# Altium project VOU_SOM_CV_V0.0.1.PrjPcb (part 2 of 2)

## Sheet HPS_DDR3.SchDoc
size A1
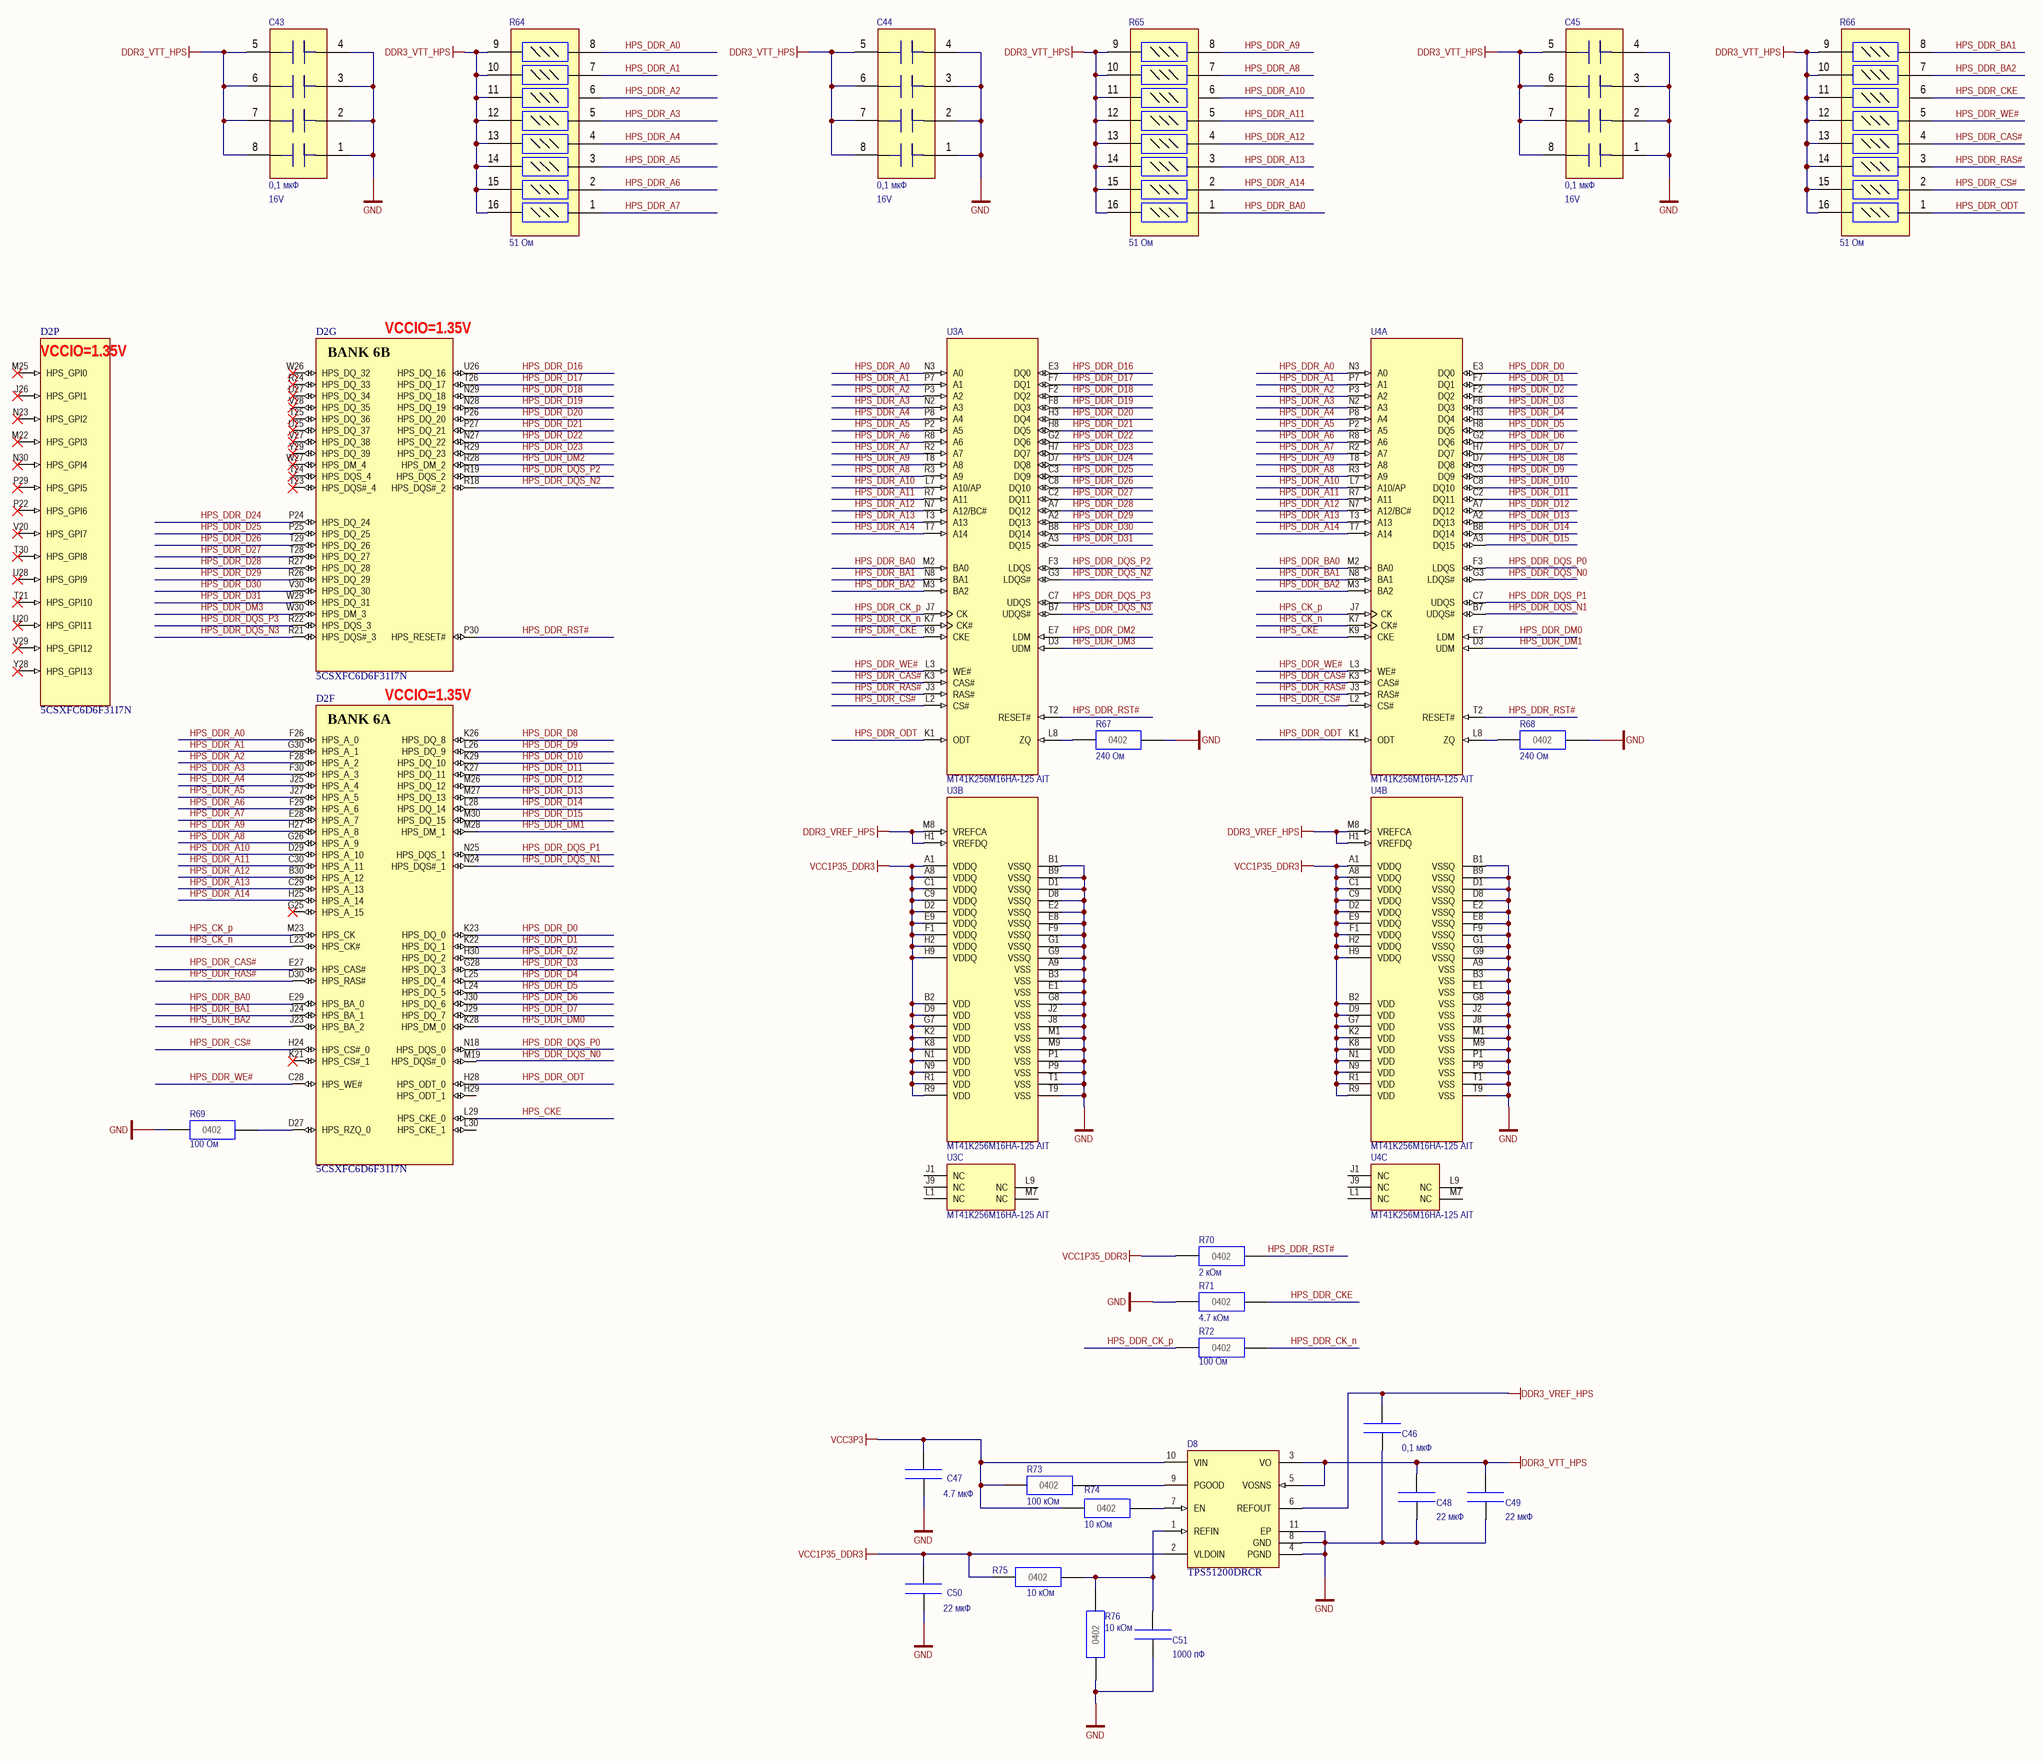
[diagram p5: HPS_DDR3.SchDoc]

### Parts
C43  value 0,1 мкФ  V: 16V  [CAF-80P319X159-8N]  (hidden comment: W3A4YC104KAT2A)
C44  value 0,1 мкФ  V: 16V  [CAF-80P319X159-8N]  (hidden comment: W3A4YC104KAT2A)
C45  value 0,1 мкФ  V: 16V  [CAF-80P319X159-8N]  (hidden comment: W3A4YC104KAT2A)
C46  value 0,1 мкФ  [CC0402(1005)]  (hidden comment: CC0402-X7R-0,1 мкФ-20%-10В)
C47  value 4.7 мкФ  [CC0402(1005)]  (hidden comment: CC0402-X5R-4.7 мкФ-20%-6.3В)
C48  value 22 мкФ  [CC0402(1005)]  (hidden comment: CC0402-X5R-22 мкФ-20%-6.3В)
C49  value 22 мкФ  [CC0402(1005)]  (hidden comment: CC0402-X5R-22 мкФ-20%-6.3В)
C50  value 22 мкФ  [CC0402(1005)]  (hidden comment: CC0402-X5R-22 мкФ-20%-6.3В)
C51  value 1000 пФ  [CC0402(1005)]  (hidden comment: CC0402-NP01000 пФ-1%-50В)
D2  5CSXFC6D6F31I7N  [ALTR-FBGA896_A-200]  (parts F,G,P of 24)
D8  TPS51200DRCR  [TI-DRC10-2400X1650TP_V]
R64  value 51 Ом  [CAT16-J8]  (hidden comment: YC248-JR-07-51 Ом)
R65  value 51 Ом  [CAT16-J8]  (hidden comment: YC248-JR-07-51 Ом)
R66  value 51 Ом  [CAT16-J8]  (hidden comment: YC248-JR-07-51 Ом)
R67  value 240 Ом  [CR0402(1005)]  (hidden comment: CR0402-240 Ом-±5%)
R68  value 240 Ом  [CR0402(1005)]  (hidden comment: CR0402-240 Ом-±5%)
R69  value 100 Ом  [CR0402(1005)]  (hidden comment: CR0402-100 Ом-±5%)
R70  value 2 кОм  [CR0402(1005)]  (hidden comment: CR0402-2 кОм-±5%)
R71  value 4.7 кОм  [CR0402(1005)]  (hidden comment: CR0402-4.7 кОм-±5%)
R72  value 100 Ом  [CR0402(1005)]  (hidden comment: CR0402-100 Ом-±5%)
R73  value 100 кОм  [CR0402(1005)]  (hidden comment: CR0402-100 кОм-±5%)
R74  value 10 кОм  [CR0402(1005)]  (hidden comment: CR0402-10 кОм-±5%)
R75  value 10 кОм  [CR0402(1005)]  (hidden comment: CR0402-10 кОм-±5%)
R76  value 10 кОм  [CR0402(1005)]  (hidden comment: CR0402-10 кОм-±5%)
U3  MT41K256M16HA-125 AIT  [MICT-HA-96]  (parts A,B,C of 3)
U4  MT41K256M16HA-125 AIT  [MICT-HA-96]  (parts A,B,C of 3)

### Nets
DDR3_VREF_HPS: C46.1(+) D8.6(REFOUT) U3.H1(VREFDQ) U3.M8(VREFCA) U4.H1(VREFDQ) U4.M8(VREFCA)
DDR3_VTT_HPS: C43.5 C43.6 C43.7 C43.8 C44.5 C44.6 C44.7 C44.8 C45.5 C45.6 C45.7 C45.8 C48.1(+) C49.1(+) D8.3(VO) D8.5(VOSNS) R64.9 R64.10 R64.11 R64.12 R64.13 R64.14 R64.15 R64.16 R65.9 R65.10 R65.11 R65.12 R65.13 R65.14 R65.15 R65.16 R66.9 R66.10 R66.11 R66.12 R66.13 R66.14 R66.15 R66.16
GND: C43.1 C43.2 C43.3 C43.4 C44.1 C44.2 C44.3 C44.4 C45.1 C45.2 C45.3 C45.4 C46.2(-) C47.2(-) C48.2(-) C49.2(-) C50.2(-) C51.2(-) D8.4(PGND) D8.8(GND) D8.11(EP) R67.2(-) R68.2(-) R69.1(+) R71.1(+) R76.1(+) U3.A9(VSS) U3.B1(VSSQ) U3.B3(VSS) U3.B9(VSSQ) U3.D1(VSSQ) U3.D8(VSSQ) U3.E1(VSS) U3.E2(VSSQ) U3.E8(VSSQ) U3.F9(VSSQ) U3.G1(VSSQ) U3.G8(VSS) U3.G9(VSSQ) U3.J2(VSS) U3.J8(VSS) U3.M1(VSS) U3.M9(VSS) U3.P1(VSS) U3.P9(VSS) U3.T1(VSS) U3.T9(VSS) U4.A9(VSS) U4.B1(VSSQ) U4.B3(VSS) U4.B9(VSSQ) U4.D1(VSSQ) U4.D8(VSSQ) U4.E1(VSS) U4.E2(VSSQ) U4.E8(VSSQ) U4.F9(VSSQ) U4.G1(VSSQ) U4.G8(VSS) U4.G9(VSSQ) U4.J2(VSS) U4.J8(VSS) U4.M1(VSS) U4.M9(VSS) U4.P1(VSS) U4.P9(VSS) U4.T1(VSS) U4.T9(VSS)
VCC1P35_DDR3: C50.1(+) D8.2(VLDOIN) R70.1(+) R75.1(+) U3.A1(VDDQ) U3.A8(VDDQ) U3.B2(VDD) U3.C1(VDDQ) U3.C9(VDDQ) U3.D2(VDDQ) U3.D9(VDD) U3.E9(VDDQ) U3.F1(VDDQ) U3.G7(VDD) U3.H2(VDDQ) U3.H9(VDDQ) U3.K2(VDD) U3.K8(VDD) U3.N1(VDD) U3.N9(VDD) U3.R1(VDD) U3.R9(VDD) U4.A1(VDDQ) U4.A8(VDDQ) U4.B2(VDD) U4.C1(VDDQ) U4.C9(VDDQ) U4.D2(VDDQ) U4.D9(VDD) U4.E9(VDDQ) U4.F1(VDDQ) U4.G7(VDD) U4.H2(VDDQ) U4.H9(VDDQ) U4.K2(VDD) U4.K8(VDD) U4.N1(VDD) U4.N9(VDD) U4.R1(VDD) U4.R9(VDD)
VCC3P3: C47.1(+) D8.10(VIN) R73.1(+) R74.1(+)
HPS_CK_n: D2.L23(HPS_CK#) U4.K7(CK#)
HPS_CK_p: D2.M23(HPS_CK) U4.J7(CK)
HPS_CKE: D2.L29(HPS_CKE_0) U4.K9(CKE)
HPS_DDR_A0: D2.F26(HPS_A_0) R64.8 U3.N3(A0) U4.N3(A0)
HPS_DDR_A1: D2.G30(HPS_A_1) R64.7 U3.P7(A1) U4.P7(A1)
HPS_DDR_A2: D2.F28(HPS_A_2) R64.6 U3.P3(A2) U4.P3(A2)
HPS_DDR_A3: D2.F30(HPS_A_3) R64.5 U3.N2(A3) U4.N2(A3)
HPS_DDR_A4: D2.J25(HPS_A_4) R64.4 U3.P8(A4) U4.P8(A4)
HPS_DDR_A5: D2.J27(HPS_A_5) R64.3 U3.P2(A5) U4.P2(A5)
HPS_DDR_A6: D2.F29(HPS_A_6) R64.2 U3.R8(A6) U4.R8(A6)
HPS_DDR_A7: D2.E28(HPS_A_7) R64.1 U3.R2(A7) U4.R2(A7)
HPS_DDR_A8: D2.G26(HPS_A_9) R65.7 U3.R3(A9) U4.R3(A9)
HPS_DDR_A9: D2.H27(HPS_A_8) R65.8 U3.T8(A8) U4.T8(A8)
HPS_DDR_A10: D2.D29(HPS_A_10) R65.6 U3.L7(A10/AP) U4.L7(A10/AP)
HPS_DDR_A11: D2.C30(HPS_A_11) R65.5 U3.R7(A11) U4.R7(A11)
HPS_DDR_A12: D2.B30(HPS_A_12) R65.4 U3.N7(A12/BC#) U4.N7(A12/BC#)
HPS_DDR_A13: D2.C29(HPS_A_13) R65.3 U3.T3(A13) U4.T3(A13)
HPS_DDR_A14: D2.H25(HPS_A_14) R65.2 U3.T7(A14) U4.T7(A14)
HPS_DDR_BA0: D2.E29(HPS_BA_0) R65.1 U3.M2(BA0) U4.M2(BA0)
HPS_DDR_BA1: D2.J24(HPS_BA_1) R66.8 U3.N8(BA1) U4.N8(BA1)
HPS_DDR_BA2: D2.J23(HPS_BA_2) R66.7 U3.M3(BA2) U4.M3(BA2)
HPS_DDR_CAS#: D2.E27(HPS_CAS#) R66.4 U3.K3(CAS#) U4.K3(CAS#)
HPS_DDR_CK_n: R72.2(-) U3.K7(CK#)
HPS_DDR_CK_p: R72.1(+) U3.J7(CK)
HPS_DDR_CKE: R66.6 R71.2(-) U3.K9(CKE)
HPS_DDR_CS#: D2.H24(HPS_CS#_0) R66.2 U3.L2(CS#) U4.L2(CS#)
HPS_DDR_D0: D2.K23(HPS_DQ_0) U4.E3(DQ0)
HPS_DDR_D1: D2.K22(HPS_DQ_1) U4.F7(DQ1)
HPS_DDR_D2: D2.H30(HPS_DQ_2) U4.F2(DQ2)
HPS_DDR_D3: D2.G28(HPS_DQ_3) U4.F8(DQ3)
HPS_DDR_D4: D2.L25(HPS_DQ_4) U4.H3(DQ4)
HPS_DDR_D5: D2.L24(HPS_DQ_5) U4.H8(DQ5)
HPS_DDR_D6: D2.J30(HPS_DQ_6) U4.G2(DQ6)
HPS_DDR_D7: D2.J29(HPS_DQ_7) U4.H7(DQ7)
HPS_DDR_D8: D2.K26(HPS_DQ_8) U4.D7(DQ8)
HPS_DDR_D9: D2.L26(HPS_DQ_9) U4.C3(DQ9)
HPS_DDR_D10: D2.K29(HPS_DQ_10) U4.C8(DQ10)
HPS_DDR_D11: D2.K27(HPS_DQ_11) U4.C2(DQ11)
HPS_DDR_D12: D2.M26(HPS_DQ_12) U4.A7(DQ12)
HPS_DDR_D13: D2.M27(HPS_DQ_13) U4.A2(DQ13)
HPS_DDR_D14: D2.L28(HPS_DQ_14) U4.B8(DQ14)
HPS_DDR_D15: D2.M30(HPS_DQ_15) U4.A3(DQ15)
HPS_DDR_D16: D2.U26(HPS_DQ_16) U3.E3(DQ0)
HPS_DDR_D17: D2.T26(HPS_DQ_17) U3.F7(DQ1)
HPS_DDR_D18: D2.N29(HPS_DQ_18) U3.F2(DQ2)
HPS_DDR_D19: D2.N28(HPS_DQ_19) U3.F8(DQ3)
HPS_DDR_D20: D2.P26(HPS_DQ_20) U3.H3(DQ4)
HPS_DDR_D21: D2.P27(HPS_DQ_21) U3.H8(DQ5)
HPS_DDR_D22: D2.N27(HPS_DQ_22) U3.G2(DQ6)
HPS_DDR_D23: D2.R29(HPS_DQ_23) U3.H7(DQ7)
HPS_DDR_D24: D2.P24(HPS_DQ_24) U3.D7(DQ8)
HPS_DDR_D25: D2.P25(HPS_DQ_25) U3.C3(DQ9)
HPS_DDR_D26: D2.T29(HPS_DQ_26) U3.C8(DQ10)
HPS_DDR_D27: D2.T28(HPS_DQ_27) U3.C2(DQ11)
HPS_DDR_D28: D2.R27(HPS_DQ_28) U3.A7(DQ12)
HPS_DDR_D29: D2.R26(HPS_DQ_29) U3.A2(DQ13)
HPS_DDR_D30: D2.V30(HPS_DQ_30) U3.B8(DQ14)
HPS_DDR_D31: D2.W29(HPS_DQ_31) U3.A3(DQ15)
HPS_DDR_DM0: D2.K28(HPS_DM_0) U4.E7(LDM)
HPS_DDR_DM1: D2.M28(HPS_DM_1) U4.D3(UDM)
HPS_DDR_DM2: D2.R28(HPS_DM_2) U3.E7(LDM)
HPS_DDR_DM3: D2.W30(HPS_DM_3) U3.D3(UDM)
HPS_DDR_DQS_N0: D2.M19(HPS_DQS#_0) U4.G3(LDQS#)
HPS_DDR_DQS_N1: D2.N24(HPS_DQS#_1) U4.B7(UDQS#)
HPS_DDR_DQS_N2: D2.R18(HPS_DQS#_2) U3.G3(LDQS#)
HPS_DDR_DQS_N3: D2.R21(HPS_DQS#_3) U3.B7(UDQS#)
HPS_DDR_DQS_P0: D2.N18(HPS_DQS_0) U4.F3(LDQS)
HPS_DDR_DQS_P1: D2.N25(HPS_DQS_1) U4.C7(UDQS)
HPS_DDR_DQS_P2: D2.R19(HPS_DQS_2) U3.F3(LDQS)
HPS_DDR_DQS_P3: D2.R22(HPS_DQS_3) U3.C7(UDQS)
HPS_DDR_ODT: D2.H28(HPS_ODT_0) R66.1 U3.K1(ODT) U4.K1(ODT)
HPS_DDR_RAS#: D2.D30(HPS_RAS#) R66.3 U3.J3(RAS#) U4.J3(RAS#)
HPS_DDR_RST#: D2.P30(HPS_RESET#) R70.2(-) U3.T2(RESET#) U4.T2(RESET#)
HPS_DDR_WE#: D2.C28(HPS_WE#) R66.5 U3.L3(WE#) U4.L3(WE#)
NetC51_1: C51.1(+) D8.1(REFIN) R75.2(-) R76.2(-)
NetD2_D27: D2.D27(HPS_RZQ_0) R69.2(-)
NetD8_7: D8.7(EN) R74.2(-)
NetD8_9: D8.9(PGOOD) R73.2(-)
NetR67_1: R67.1(+) U3.L8(ZQ)
NetR68_1: R68.1(+) U4.L8(ZQ)

Not connected (* = marked no-connect by the designer): D2 G25(HPS_A_15)* H29(HPS_ODT_1) J26(HPS_GPI1)* K21(HPS_CS#_1)* L30(HPS_CKE_1) M22(HPS_GPI3)* M25(HPS_GPI0)* N23(HPS_GPI2)* N30(HPS_GPI4)* P22(HPS_GPI6)* P29(HPS_GPI5)* R24(HPS_DQ_33)* T21(HPS_GPI10)* T23(HPS_DQS#_4)* T24(HPS_DQS_4)* T25(HPS_DQ_36)* T30(HPS_GPI8)* U20(HPS_GPI11)* U25(HPS_DQ_37)* U27(HPS_DQ_34)* U28(HPS_GPI9)* V20(HPS_GPI7)* V27(HPS_DQ_38)* V28(HPS_DQ_35)* V29(HPS_GPI12)* W26(HPS_DQ_32)* W27(HPS_DM_4)* Y28(HPS_GPI13)* Y29(HPS_DQ_39)*; U3 J1(NC) J9(NC) L1(NC) L9(NC) M7(NC); U4 J1(NC) J9(NC) L1(NC) L9(NC) M7(NC)

### Notes on the sheet
- (near D2) VCCIO=1.35V
- (in symbol 5CSXFC6D6F31I7N, part F) BANK 6A
- (in symbol 5CSXFC6D6F31I7N, part G) BANK 6B
- (in symbol CR0402-#-±5%) 0402

### Library data of the parts
C43-C45 = W3A4YC104KAT2A: Чип конденсатор керамический; T: ±10%; TC: X7R; Supplier 1: Digi-Key; Supplier Part Number 1: 478-2879-2-ND
C46-C51 = CC0402-X7R-#-20%-10В: Чип конденсатор керамический; Supplier 1: Digi-Key
  C46: Supplier Part Number 1: 399-3520-1-ND
  C47-C50: Supplier Part Number 1: CC0402MRX5R4BB226
  C51: Supplier Part Number 1: GRM1555C1H102FA01D
D2 = 5CSXFC6D6F31I7N: Cyclone V SX Family FPGA, 1.07 to 1.13 V Supply, 288 I/O Pins, 6 PLLs, 896-Pin FBGA, Speed Grade 7, Industrial Grade, RoHS Compliant; Manufacturer: Altera; Logic Elements (LE) (K): 110; Speed Grade: 7; DatasheetVersion: Rev. 3.4; PackageVersion: Rev. 2.0, 12/2012; PackageReference: FBGA896_A-200; PackageDescription: 896-Pin FineLine Ball-Grid Array (FBGA), Body 31 x 31 mm, Pitch 1 mm; Supplier 1: Digi-Key; Supplier Part Number 1: 5CSXFC6D6F31I7N-ND; Supplier 2: Mouser; Supplier Part Number 2: 989-5CSXFC6D6F31I7N; Device Group: 5CSXFC6; RoHS: RoHS Compliant; Subcategory: Cyclone V SX; Voltage Supply: 1.07 to 1.13 V; NexusDeviceID: 5CSXFC6D6F31I7N; Mounting Technology: Surface Mount; Code_JEDEC: MS-034; PartNumber: 5CSXFC6D6F31I7N; ComponentLink1Description: Manufacturer URL; ComponentLink1URL: http://www.altera.com; ComponentLink2Description: Datasheet; ComponentLink2URL: http://www.altera.com/literature/hb/cyclone-v/cv_51002.pdf; ComponentLink3Description: Package Specification; ComponentLink3URL: http://www.altera.com/devicepackaging/04R00435-01.pdf; ComponentLink4Description: Device Handbook URL; ComponentLink4URL: http://www.altera.com/literature/hb/cyclone-v/cyclone5_handbook.pdf; ComponentLink5Description: Device Pin-Out URL; ComponentLink5URL: http://www.altera.com/literature/dp/cyclone-v/5CSXFC6.xls; ComponentLink6Description: Product URL; ComponentLink6URL: http://www.buyaltera.com/scripts/partsearch.dll?Detail&name=5CSXFC6D6F31I7N-ND
D8 = TPS51200DRCR: Single Output LDO, 3 A, 2.375 to 3.5 V Input, with DDR Termination, 10-pin SON (DRC), -40 to 85 degC, Green (RoHS & no Sb/Br); Manufacturer: Texas Instruments; Iout(Max)(A): 3; Iq(Typ)(mA): 0.5; Power Good: TRUE; Rating: Catalog; SubFamily: Single Channel LDO; Vin(Max)(V): 3.5; Vin(Min)(V): 2.3; DatasheetVersion: SLUS812; PackageVersion: 4204102-3/L; PackageReference: DRC10-2400X1650TP; PackageDescription: 10-Pin Plastic Small Outline, Body 3 x 3 mm, Pitch 0.5 mm; Supplier 1: Digi-Key; Supplier Part Number 1: 296-26978-2-ND; Supplier 2: Digi-Key; Supplier Part Number 2: 296-26978-1-ND; Supplier 3: Digi-Key; Supplier Part Number 3: 296-26978-6-ND; Supplier 4: Farnell; Supplier Part Number 4: 2126004; Supplier 5: Newark; Supplier Part Number 5: 94T5094; Supplier 6: Newark; Supplier Part Number 6: 11N9832; Supplier 7: Mouser; Supplier Part Number 7: 595-TPS51200DRCR; Eco-Plan: Green (RoHS & no Sb/Br); Mounting Technology: Surface Mount; PartNumber: TPS51200DRCR; ComponentLink1Description: Manufacturer URL; ComponentLink1URL: http://www.ti.com/; ComponentLink2Description: Datasheet; ComponentLink2URL: http://www.ti.com/general/docs/lit/getliterature.tsp?genericPartNumber=TPS51200&fileType=pdf; ComponentLink3Description: Package Specification; ComponentLink3URL: http://www.ti.com/litv/pdf/mpds117k; ComponentLink4Description: URL Link1; ComponentLink4URL: Samples URL:http://www.ti.com/product/tps51200#samples
R64-R66 = YC248-JR-07-#: Набор чип резисторов; P: 0.062 Вт; Supplier 1: Digi-Key; Supplier Part Number 1: YC248-JR-0751RL
R67-R76 = CR0402-#-±5%: Чип резистор; Maximum Working Voltage: 50 В; TOLERANCE: 5%; Supplier 1: Digi-Key
  R67 R68: Supplier Part Number 1: 311-240JRTR-ND
  R69 R72: Supplier Part Number 1: 311-100JRTR-ND
  R70: Supplier Part Number 1: 311-2.0KJRTR-ND
  R71: Supplier Part Number 1: 311-4.7KJRTR-ND
  R73: Supplier Part Number 1: 311-100KJRTR-ND
  R74-R76: Supplier Part Number 1: 311-10.0KJRTR-ND
U3 U4 = MT41K256M16HA-125 AIT: 4Gb DDR3-1600 SDRAM, 256Mb x 16, 1.25ns, 1.35V, -40 to 95 degC, 96-Ball FBGA, Pb-Free; Manufacturer: Micron; CL: CL = 11; Clock Rate: 800 MHz; Op. Temp.: -40C to +95C; DatasheetVersion: Rev. E; PackageVersion: Rev.E; PackageReference: MICT-HA-96; PackageDescription: 96-Ball Fine-Pitch Ball Grid Array, 14 x 9 mm, Pitch 0.8 mm; Cycle Time: 1.25ns; Data Rate: DDR3-1600; Density: 4Gb; Depth: 256Mb; Package: FBGA; Pin Count: 96-ball; RoHS: Yes; Voltage: 1.35V; Width: x16; Mounting Technology: Surface Mount; PartNumber: MT41K256M16HA-125 AIT; ComponentLink1Description: Manufacturer URL; ComponentLink1URL: http://www.micron.com/; ComponentLink2Description: Datasheet; ComponentLink2URL: http://www.micron.com/~/media/Documents/Products/Data%20Sheet/DRAM/4Gb_1_35V_DDR3L.pdf; ComponentLink3Description: Package Specification; ComponentLink3URL: http://www.micron.com/~/media/Documents/Products/Data%20Sheet/DRAM/4Gb_1_35V_DDR3L.pdf

## Sheet HPS_IOs.SchDoc
size A1
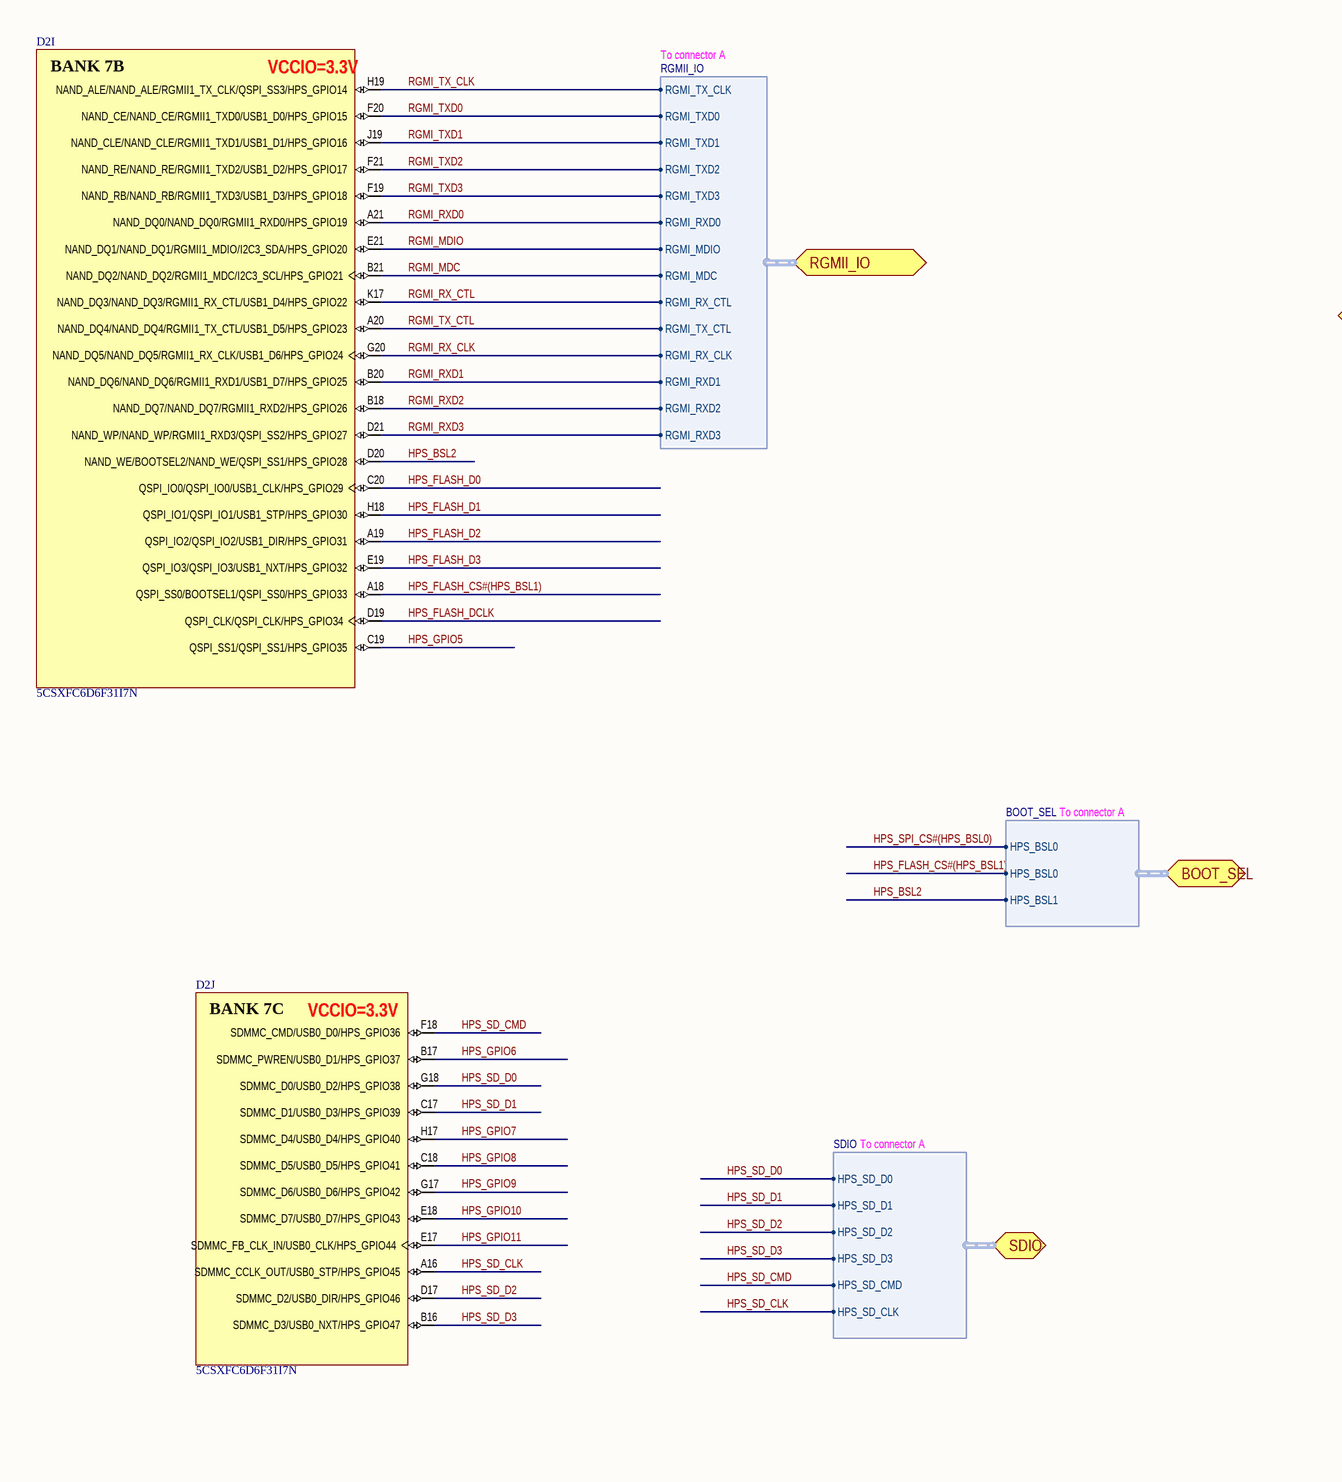
[diagram p6: HPS_IOs.SchDoc, left]
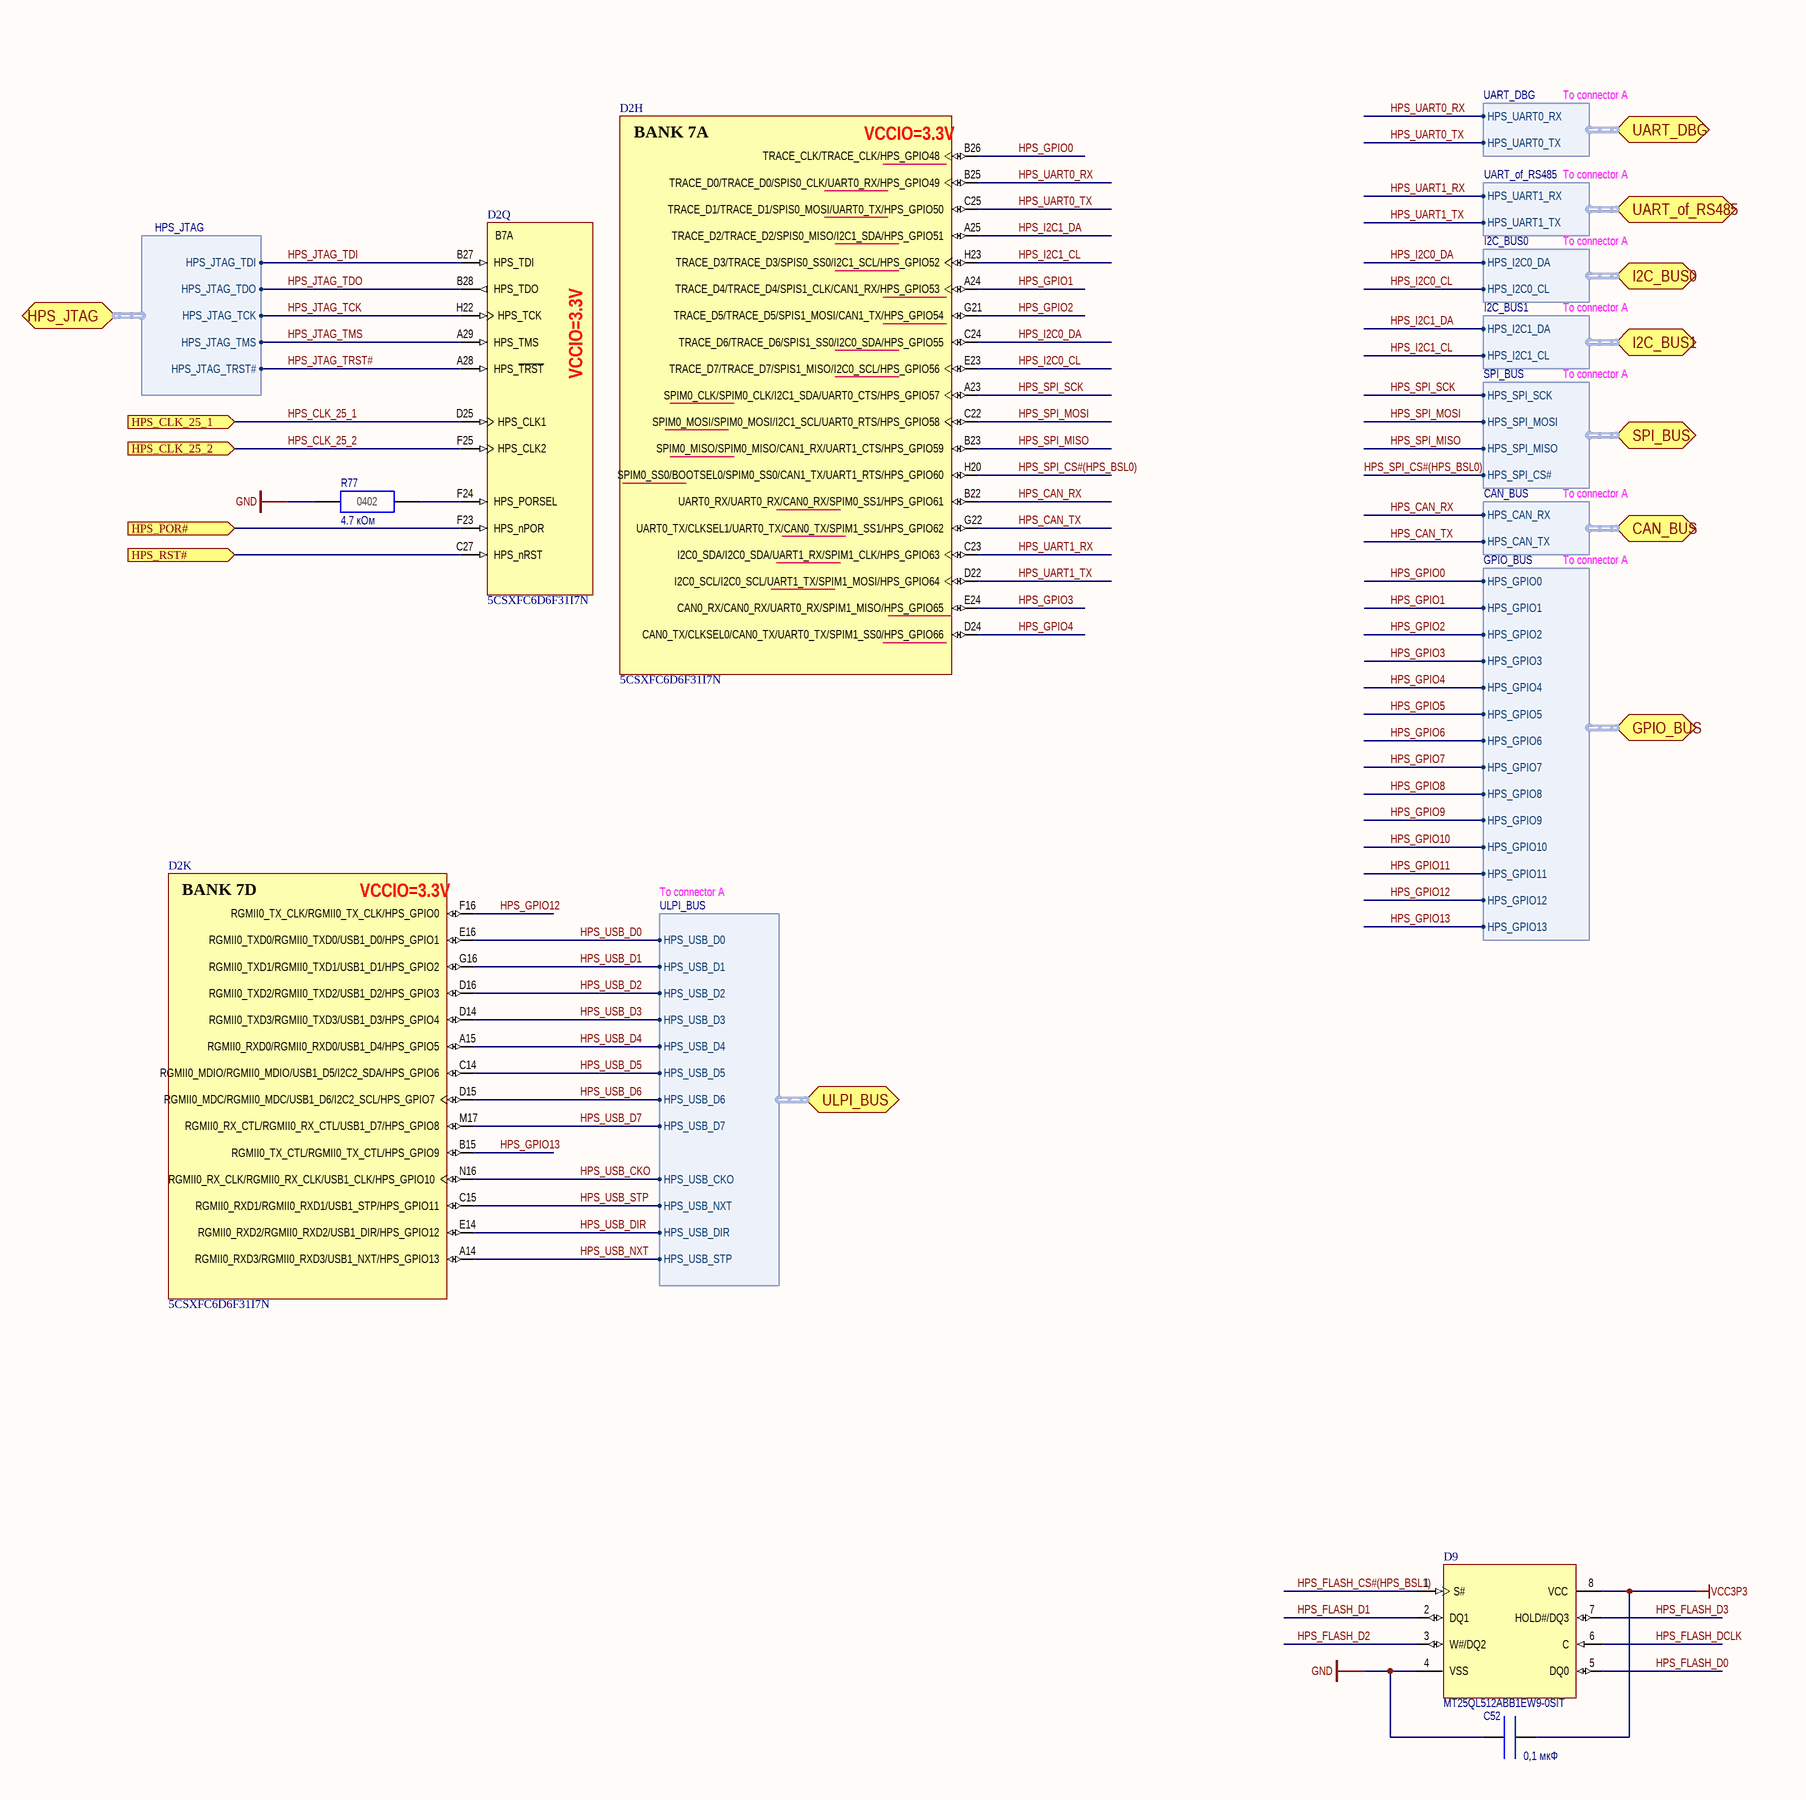
[diagram p7: HPS_IOs.SchDoc, right]

### Parts
C52  value 0,1 мкФ  [CC0402(1005)]  (hidden comment: CC0402-X7R-0,1 мкФ-20%-10В)
D2  5CSXFC6D6F31I7N  [ALTR-FBGA896_A-200]  (parts H,I,J,K,Q of 24)
D9  MT25QL512ABB1EW9-0SIT  [SON127P800X80_HS-9N]
R77  value 4.7 кОм  [CR0402(1005)]  (hidden comment: CR0402-4.7 кОм-±5%)

### Ports
BOOT_SEL (harness BOOT_SEL), CAN_BUS (harness CAN_BUS), GPIO_BUS (harness GPIO_BUS), HPS_CLK_25_1 (in), HPS_CLK_25_2 (in), HPS_JTAG (harness HPS_JTAG), HPS_POR# (in), HPS_RST# (in), I2C_BUS0 (harness I2C_BUS0), I2C_BUS1 (harness I2C_BUS1), RGMII_IO (harness RGMII_IO), SDIO (harness SDIO), SPI_BUS (harness SPI_BUS), UART_DBG (harness UART_DBG), UART_of_RS485 (harness UART_of_RS485), ULPI_BUS (harness ULPI_BUS)

### Harnesses
HPS_JTAG: HPS_JTAG_TDI, HPS_JTAG_TDO, HPS_JTAG_TCK, HPS_JTAG_TMS, HPS_JTAG_TRST#
ULPI_BUS: HPS_USB_D0, HPS_USB_D1, HPS_USB_D2, HPS_USB_D3, HPS_USB_D4, HPS_USB_D5, HPS_USB_D6, HPS_USB_D7, HPS_USB_CKO, HPS_USB_NXT, HPS_USB_DIR, HPS_USB_STP
UART_DBG: HPS_UART0_RX, HPS_UART0_TX
UART_of_RS485: HPS_UART1_RX, HPS_UART1_TX
GPIO_BUS: HPS_GPIO0, HPS_GPIO1, HPS_GPIO2, HPS_GPIO3, HPS_GPIO4, HPS_GPIO5, HPS_GPIO6, HPS_GPIO7, HPS_GPIO8, HPS_GPIO9, HPS_GPIO10, HPS_GPIO11, HPS_GPIO12, HPS_GPIO13
SPI_BUS: HPS_SPI_MOSI, HPS_SPI_MISO, HPS_SPI_SCK, HPS_SPI_CS#
I2C_BUS0: HPS_I2C0_DA, HPS_I2C0_CL
I2C_BUS1: HPS_I2C1_DA, HPS_I2C1_CL
CAN_BUS: HPS_CAN_TX, HPS_CAN_RX
SDIO: HPS_SD_D0, HPS_SD_D1, HPS_SD_D2, HPS_SD_D3, HPS_SD_CMD, HPS_SD_CLK
RGMII_IO: RGMI_TX_CLK, RGMI_TXD0, RGMI_TXD1, RGMI_TXD2, RGMI_TXD3, RGMI_RXD0, RGMI_RXD1, RGMI_RXD2, RGMI_RXD3, RGMI_TX_CTL, RGMI_RX_CTL, RGMI_RX_CLK, RGMI_MDIO, RGMI_MDC
BOOT_SEL: HPS_BSL0, HPS_BSL0, HPS_BSL1

### Nets
GND: C52.1(+) D9.4(VSS) R77.1(+)
VCC3P3: C52.2(-) D9.8(VCC)
HPS_BSL2: D2.D20(NAND_WE/BOOTSEL2/NAND_WE/QSPI_SS1/HPS_GPIO28) ; port BOOT_SEL.HPS_BSL1
HPS_CAN_RX: D2.B22(UART0_RX/UART0_RX/CAN0_RX/SPIM0_SS1/HPS_GPIO61) ; port CAN_BUS.HPS_CAN_RX
HPS_CAN_TX: D2.G22(UART0_TX/CLKSEL1/UART0_TX/CAN0_TX/SPIM1_SS1/HPS_GPIO62) ; port CAN_BUS.HPS_CAN_TX
HPS_CLK_25_1: D2.D25(HPS_CLK1) ; port HPS_CLK_25_1
HPS_CLK_25_2: D2.F25(HPS_CLK2) ; port HPS_CLK_25_2
HPS_FLASH_CS#(HPS_BSL1): D2.A18(QSPI_SS0/BOOTSEL1/QSPI_SS0/HPS_GPIO33) D2.H20(SPIM0_SS0/BOOTSEL0/SPIM0_SS0/CAN1_TX/UART1_RTS/HPS_GPIO60) D9.1(S#) ; port SPI_BUS.HPS_SPI_CS#, port BOOT_SEL.HPS_BSL0  [also labelled HPS_SPI_CS#(HPS_BSL0)]  [project net HPS_BSL0]
HPS_FLASH_D0: D2.C20(QSPI_IO0/QSPI_IO0/USB1_CLK/HPS_GPIO29) D9.5(DQ0)
HPS_FLASH_D1: D2.H18(QSPI_IO1/QSPI_IO1/USB1_STP/HPS_GPIO30) D9.2(DQ1)
HPS_FLASH_D2: D2.A19(QSPI_IO2/QSPI_IO2/USB1_DIR/HPS_GPIO31) D9.3(W#/DQ2)
HPS_FLASH_D3: D2.E19(QSPI_IO3/QSPI_IO3/USB1_NXT/HPS_GPIO32) D9.7(HOLD#/DQ3)
HPS_FLASH_DCLK: D2.D19(QSPI_CLK/QSPI_CLK/HPS_GPIO34) D9.6(C)
HPS_GPIO0: D2.B26(TRACE_CLK/TRACE_CLK/HPS_GPIO48) ; port GPIO_BUS.HPS_GPIO0
HPS_GPIO1: D2.A24(TRACE_D4/TRACE_D4/SPIS1_CLK/CAN1_RX/HPS_GPIO53) ; port GPIO_BUS.HPS_GPIO1
HPS_GPIO2: D2.G21(TRACE_D5/TRACE_D5/SPIS1_MOSI/CAN1_TX/HPS_GPIO54) ; port GPIO_BUS.HPS_GPIO2
HPS_GPIO3: D2.E24(CAN0_RX/CAN0_RX/UART0_RX/SPIM1_MISO/HPS_GPIO65) ; port GPIO_BUS.HPS_GPIO3
HPS_GPIO4: D2.D24(CAN0_TX/CLKSEL0/CAN0_TX/UART0_TX/SPIM1_SS0/HPS_GPIO66) ; port GPIO_BUS.HPS_GPIO4
HPS_GPIO5: D2.C19(QSPI_SS1/QSPI_SS1/HPS_GPIO35) ; port GPIO_BUS.HPS_GPIO5
HPS_GPIO6: D2.B17(SDMMC_PWREN/USB0_D1/HPS_GPIO37) ; port GPIO_BUS.HPS_GPIO6
HPS_GPIO7: D2.H17(SDMMC_D4/USB0_D4/HPS_GPIO40) ; port GPIO_BUS.HPS_GPIO7
HPS_GPIO8: D2.C18(SDMMC_D5/USB0_D5/HPS_GPIO41) ; port GPIO_BUS.HPS_GPIO8
HPS_GPIO9: D2.G17(SDMMC_D6/USB0_D6/HPS_GPIO42) ; port GPIO_BUS.HPS_GPIO9
HPS_GPIO10: D2.E18(SDMMC_D7/USB0_D7/HPS_GPIO43) ; port GPIO_BUS.HPS_GPIO10
HPS_GPIO11: D2.E17(SDMMC_FB_CLK_IN/USB0_CLK/HPS_GPIO44) ; port GPIO_BUS.HPS_GPIO11
HPS_GPIO12: D2.F16(RGMII0_TX_CLK/RGMII0_TX_CLK/HPS_GPIO0) ; port GPIO_BUS.HPS_GPIO12
HPS_GPIO13: D2.B15(RGMII0_TX_CTL/RGMII0_TX_CTL/HPS_GPIO9) ; port GPIO_BUS.HPS_GPIO13
HPS_I2C0_CL: D2.E23(TRACE_D7/TRACE_D7/SPIS1_MISO/I2C0_SCL/HPS_GPIO56) ; port I2C_BUS0.HPS_I2C0_CL
HPS_I2C0_DA: D2.C24(TRACE_D6/TRACE_D6/SPIS1_SS0/I2C0_SDA/HPS_GPIO55) ; port I2C_BUS0.HPS_I2C0_DA
HPS_I2C1_CL: D2.H23(TRACE_D3/TRACE_D3/SPIS0_SS0/I2C1_SCL/HPS_GPIO52) ; port I2C_BUS1.HPS_I2C1_CL
HPS_I2C1_DA: D2.A25(TRACE_D2/TRACE_D2/SPIS0_MISO/I2C1_SDA/HPS_GPIO51) ; port I2C_BUS1.HPS_I2C1_DA
HPS_JTAG_TCK: D2.H22(HPS_TCK) ; port HPS_JTAG.HPS_JTAG_TCK
HPS_JTAG_TDI: D2.B27(HPS_TDI) ; port HPS_JTAG.HPS_JTAG_TDI
HPS_JTAG_TDO: D2.B28(HPS_TDO) ; port HPS_JTAG.HPS_JTAG_TDO
HPS_JTAG_TMS: D2.A29(HPS_TMS) ; port HPS_JTAG.HPS_JTAG_TMS
HPS_JTAG_TRST#: D2.A28(HPS_~{TRST}) ; port HPS_JTAG.HPS_JTAG_TRST#
HPS_SD_CLK: D2.A16(SDMMC_CCLK_OUT/USB0_STP/HPS_GPIO45) ; port SDIO.HPS_SD_CLK
HPS_SD_CMD: D2.F18(SDMMC_CMD/USB0_D0/HPS_GPIO36) ; port SDIO.HPS_SD_CMD
HPS_SD_D0: D2.G18(SDMMC_D0/USB0_D2/HPS_GPIO38) ; port SDIO.HPS_SD_D0
HPS_SD_D1: D2.C17(SDMMC_D1/USB0_D3/HPS_GPIO39) ; port SDIO.HPS_SD_D1
HPS_SD_D2: D2.D17(SDMMC_D2/USB0_DIR/HPS_GPIO46) ; port SDIO.HPS_SD_D2
HPS_SD_D3: D2.B16(SDMMC_D3/USB0_NXT/HPS_GPIO47) ; port SDIO.HPS_SD_D3
HPS_SPI_MISO: D2.B23(SPIM0_MISO/SPIM0_MISO/CAN1_RX/UART1_CTS/HPS_GPIO59) ; port SPI_BUS.HPS_SPI_MISO
HPS_SPI_MOSI: D2.C22(SPIM0_MOSI/SPIM0_MOSI/I2C1_SCL/UART0_RTS/HPS_GPIO58) ; port SPI_BUS.HPS_SPI_MOSI
HPS_SPI_SCK: D2.A23(SPIM0_CLK/SPIM0_CLK/I2C1_SDA/UART0_CTS/HPS_GPIO57) ; port SPI_BUS.HPS_SPI_SCK
HPS_UART0_RX: D2.B25(TRACE_D0/TRACE_D0/SPIS0_CLK/UART0_RX/HPS_GPIO49) ; port UART_DBG.HPS_UART0_RX
HPS_UART0_TX: D2.C25(TRACE_D1/TRACE_D1/SPIS0_MOSI/UART0_TX/HPS_GPIO50) ; port UART_DBG.HPS_UART0_TX
HPS_UART1_RX: D2.C23(I2C0_SDA/I2C0_SDA/UART1_RX/SPIM1_CLK/HPS_GPIO63) ; port UART_of_RS485.HPS_UART1_RX
HPS_UART1_TX: D2.D22(I2C0_SCL/I2C0_SCL/UART1_TX/SPIM1_MOSI/HPS_GPIO64) ; port UART_of_RS485.HPS_UART1_TX
HPS_USB_CKO: D2.N16(RGMII0_RX_CLK/RGMII0_RX_CLK/USB1_CLK/HPS_GPIO10) ; port ULPI_BUS.HPS_USB_CKO
HPS_USB_D0: D2.E16(RGMII0_TXD0/RGMII0_TXD0/USB1_D0/HPS_GPIO1) ; port ULPI_BUS.HPS_USB_D0
HPS_USB_D1: D2.G16(RGMII0_TXD1/RGMII0_TXD1/USB1_D1/HPS_GPIO2) ; port ULPI_BUS.HPS_USB_D1
HPS_USB_D2: D2.D16(RGMII0_TXD2/RGMII0_TXD2/USB1_D2/HPS_GPIO3) ; port ULPI_BUS.HPS_USB_D2
HPS_USB_D3: D2.D14(RGMII0_TXD3/RGMII0_TXD3/USB1_D3/HPS_GPIO4) ; port ULPI_BUS.HPS_USB_D3
HPS_USB_D4: D2.A15(RGMII0_RXD0/RGMII0_RXD0/USB1_D4/HPS_GPIO5) ; port ULPI_BUS.HPS_USB_D4
HPS_USB_D5: D2.C14(RGMII0_MDIO/RGMII0_MDIO/USB1_D5/I2C2_SDA/HPS_GPIO6) ; port ULPI_BUS.HPS_USB_D5
HPS_USB_D6: D2.D15(RGMII0_MDC/RGMII0_MDC/USB1_D6/I2C2_SCL/HPS_GPIO7) ; port ULPI_BUS.HPS_USB_D6
HPS_USB_D7: D2.M17(RGMII0_RX_CTL/RGMII0_RX_CTL/USB1_D7/HPS_GPIO8) ; port ULPI_BUS.HPS_USB_D7
HPS_USB_DIR: D2.E14(RGMII0_RXD2/RGMII0_RXD2/USB1_DIR/HPS_GPIO12) ; port ULPI_BUS.HPS_USB_DIR
HPS_USB_NXT: D2.A14(RGMII0_RXD3/RGMII0_RXD3/USB1_NXT/HPS_GPIO13) ; port ULPI_BUS.HPS_USB_STP
HPS_USB_STP: D2.C15(RGMII0_RXD1/RGMII0_RXD1/USB1_STP/HPS_GPIO11) ; port ULPI_BUS.HPS_USB_NXT
RGMI_MDC: D2.B21(NAND_DQ2/NAND_DQ2/RGMII1_MDC/I2C3_SCL/HPS_GPIO21) ; port RGMII_IO.RGMI_MDC
RGMI_MDIO: D2.E21(NAND_DQ1/NAND_DQ1/RGMII1_MDIO/I2C3_SDA/HPS_GPIO20) ; port RGMII_IO.RGMI_MDIO
RGMI_RX_CLK: D2.G20(NAND_DQ5/NAND_DQ5/RGMII1_RX_CLK/USB1_D6/HPS_GPIO24) ; port RGMII_IO.RGMI_RX_CLK
RGMI_RX_CTL: D2.K17(NAND_DQ3/NAND_DQ3/RGMII1_RX_CTL/USB1_D4/HPS_GPIO22) ; port RGMII_IO.RGMI_RX_CTL
RGMI_RXD0: D2.A21(NAND_DQ0/NAND_DQ0/RGMII1_RXD0/HPS_GPIO19) ; port RGMII_IO.RGMI_RXD0
RGMI_RXD1: D2.B20(NAND_DQ6/NAND_DQ6/RGMII1_RXD1/USB1_D7/HPS_GPIO25) ; port RGMII_IO.RGMI_RXD1
RGMI_RXD2: D2.B18(NAND_DQ7/NAND_DQ7/RGMII1_RXD2/HPS_GPIO26) ; port RGMII_IO.RGMI_RXD2
RGMI_RXD3: D2.D21(NAND_WP/NAND_WP/RGMII1_RXD3/QSPI_SS2/HPS_GPIO27) ; port RGMII_IO.RGMI_RXD3
RGMI_TX_CLK: D2.H19(NAND_ALE/NAND_ALE/RGMII1_TX_CLK/QSPI_SS3/HPS_GPIO14) ; port RGMII_IO.RGMI_TX_CLK
RGMI_TX_CTL: D2.A20(NAND_DQ4/NAND_DQ4/RGMII1_TX_CTL/USB1_D5/HPS_GPIO23) ; port RGMII_IO.RGMI_TX_CTL
RGMI_TXD0: D2.F20(NAND_CE/NAND_CE/RGMII1_TXD0/USB1_D0/HPS_GPIO15) ; port RGMII_IO.RGMI_TXD0
RGMI_TXD1: D2.J19(NAND_CLE/NAND_CLE/RGMII1_TXD1/USB1_D1/HPS_GPIO16) ; port RGMII_IO.RGMI_TXD1
RGMI_TXD2: D2.F21(NAND_RE/NAND_RE/RGMII1_TXD2/USB1_D2/HPS_GPIO17) ; port RGMII_IO.RGMI_TXD2
RGMI_TXD3: D2.F19(NAND_RB/NAND_RB/RGMII1_TXD3/USB1_D3/HPS_GPIO18) ; port RGMII_IO.RGMI_TXD3
NetD2_C27: D2.C27(HPS_nRST) ; port HPS_RST#
NetD2_F23: D2.F23(HPS_nPOR) ; port HPS_POR#
NetD2_F24: D2.F24(HPS_PORSEL) R77.2(-)

### Notes on the sheet
- (near D2) VCCIO=3.3V
- To connector A
- (near D2) B7A
- VCCIO=3.3V
- (in symbol 5CSXFC6D6F31I7N, part H) BANK 7A
- (in symbol 5CSXFC6D6F31I7N, part I) BANK 7B
- (in symbol 5CSXFC6D6F31I7N, part J) BANK 7C
- (in symbol 5CSXFC6D6F31I7N, part K) BANK 7D
- (in symbol CR0402-#-±5%) 0402

### Library data of the parts
C52 = CC0402-X7R-#-20%-10В: Чип конденсатор керамический; Supplier 1: Digi-Key; Supplier Part Number 1: 399-3520-1-ND
D2 = 5CSXFC6D6F31I7N: Cyclone V SX Family FPGA, 1.07 to 1.13 V Supply, 288 I/O Pins, 6 PLLs, 896-Pin FBGA, Speed Grade 7, Industrial Grade, RoHS Compliant; Manufacturer: Altera; Logic Elements (LE) (K): 110; Speed Grade: 7; DatasheetVersion: Rev. 3.4; PackageVersion: Rev. 2.0, 12/2012; PackageReference: FBGA896_A-200; PackageDescription: 896-Pin FineLine Ball-Grid Array (FBGA), Body 31 x 31 mm, Pitch 1 mm; Supplier 1: Digi-Key; Supplier Part Number 1: 5CSXFC6D6F31I7N-ND; Supplier 2: Mouser; Supplier Part Number 2: 989-5CSXFC6D6F31I7N; Device Group: 5CSXFC6; RoHS: RoHS Compliant; Subcategory: Cyclone V SX; Voltage Supply: 1.07 to 1.13 V; NexusDeviceID: 5CSXFC6D6F31I7N; Mounting Technology: Surface Mount; Code_JEDEC: MS-034; PartNumber: 5CSXFC6D6F31I7N; ComponentLink1Description: Manufacturer URL; ComponentLink1URL: http://www.altera.com; ComponentLink2Description: Datasheet; ComponentLink2URL: http://www.altera.com/literature/hb/cyclone-v/cv_51002.pdf; ComponentLink3Description: Package Specification; ComponentLink3URL: http://www.altera.com/devicepackaging/04R00435-01.pdf; ComponentLink4Description: Device Handbook URL; ComponentLink4URL: http://www.altera.com/literature/hb/cyclone-v/cyclone5_handbook.pdf; ComponentLink5Description: Device Pin-Out URL; ComponentLink5URL: http://www.altera.com/literature/dp/cyclone-v/5CSXFC6.xls; ComponentLink6Description: Product URL; ComponentLink6URL: http://www.buyaltera.com/scripts/partsearch.dll?Detail&name=5CSXFC6D6F31I7N-ND
D9 = MT25QL512ABB1EW9-0SIT: 512 Mb (x1/x2/x4) Serial NOR Flash Memory with Multi I/O, 108 MHz, 2.7 to 3.6 V, 16-pin SO16 Wide (SF), Tape & Reel; Part Family: MT25Q; Manufacturer: Micron; Density: 512Mb; Speed: 133 MHz; Voltage: 2.7V-3.6V; DatasheetVersion: Rev. J; PackageReference: 8-WDFN; PackageDescription: 8-WPDFN (6x8) (MLP8); Applications: Embedded; Package: 8-WDFN Exposed Pad; Part Status: Production; RoHS: Yes; Type: Multi I/O; Width: x1/x2/x4; Mounting Technology: Surface Mount; PartNumber: MT25QL512ABB1EW9-0SIT; ComponentLink1Description: Manufacturer URL; ComponentLink1URL: http://www.micron.com/; ComponentLink2Description: Datasheet; ComponentLink2URL: https://www.micron.com/~/media/documents/products/data-sheet/nor-flash/serial-nor/mt25q/die-rev-b/mt25q_qlkt_l_512_abb_0.pdf; ComponentLink3Description: Package Specification; ComponentLink3URL: https://www.micron.com/~/media/documents/products/data-sheet/nor-flash/serial-nor/mt25q/die-rev-b/mt25q_qlkt_l_512_abb_0.pdf
R77 = CR0402-#-±5%: Чип резистор; Maximum Working Voltage: 50 В; TOLERANCE: 5%; Supplier 1: Digi-Key; Supplier Part Number 1: 311-4.7KJRTR-ND

## Sheet CLK_src&sys_logic.SchDoc
size A2
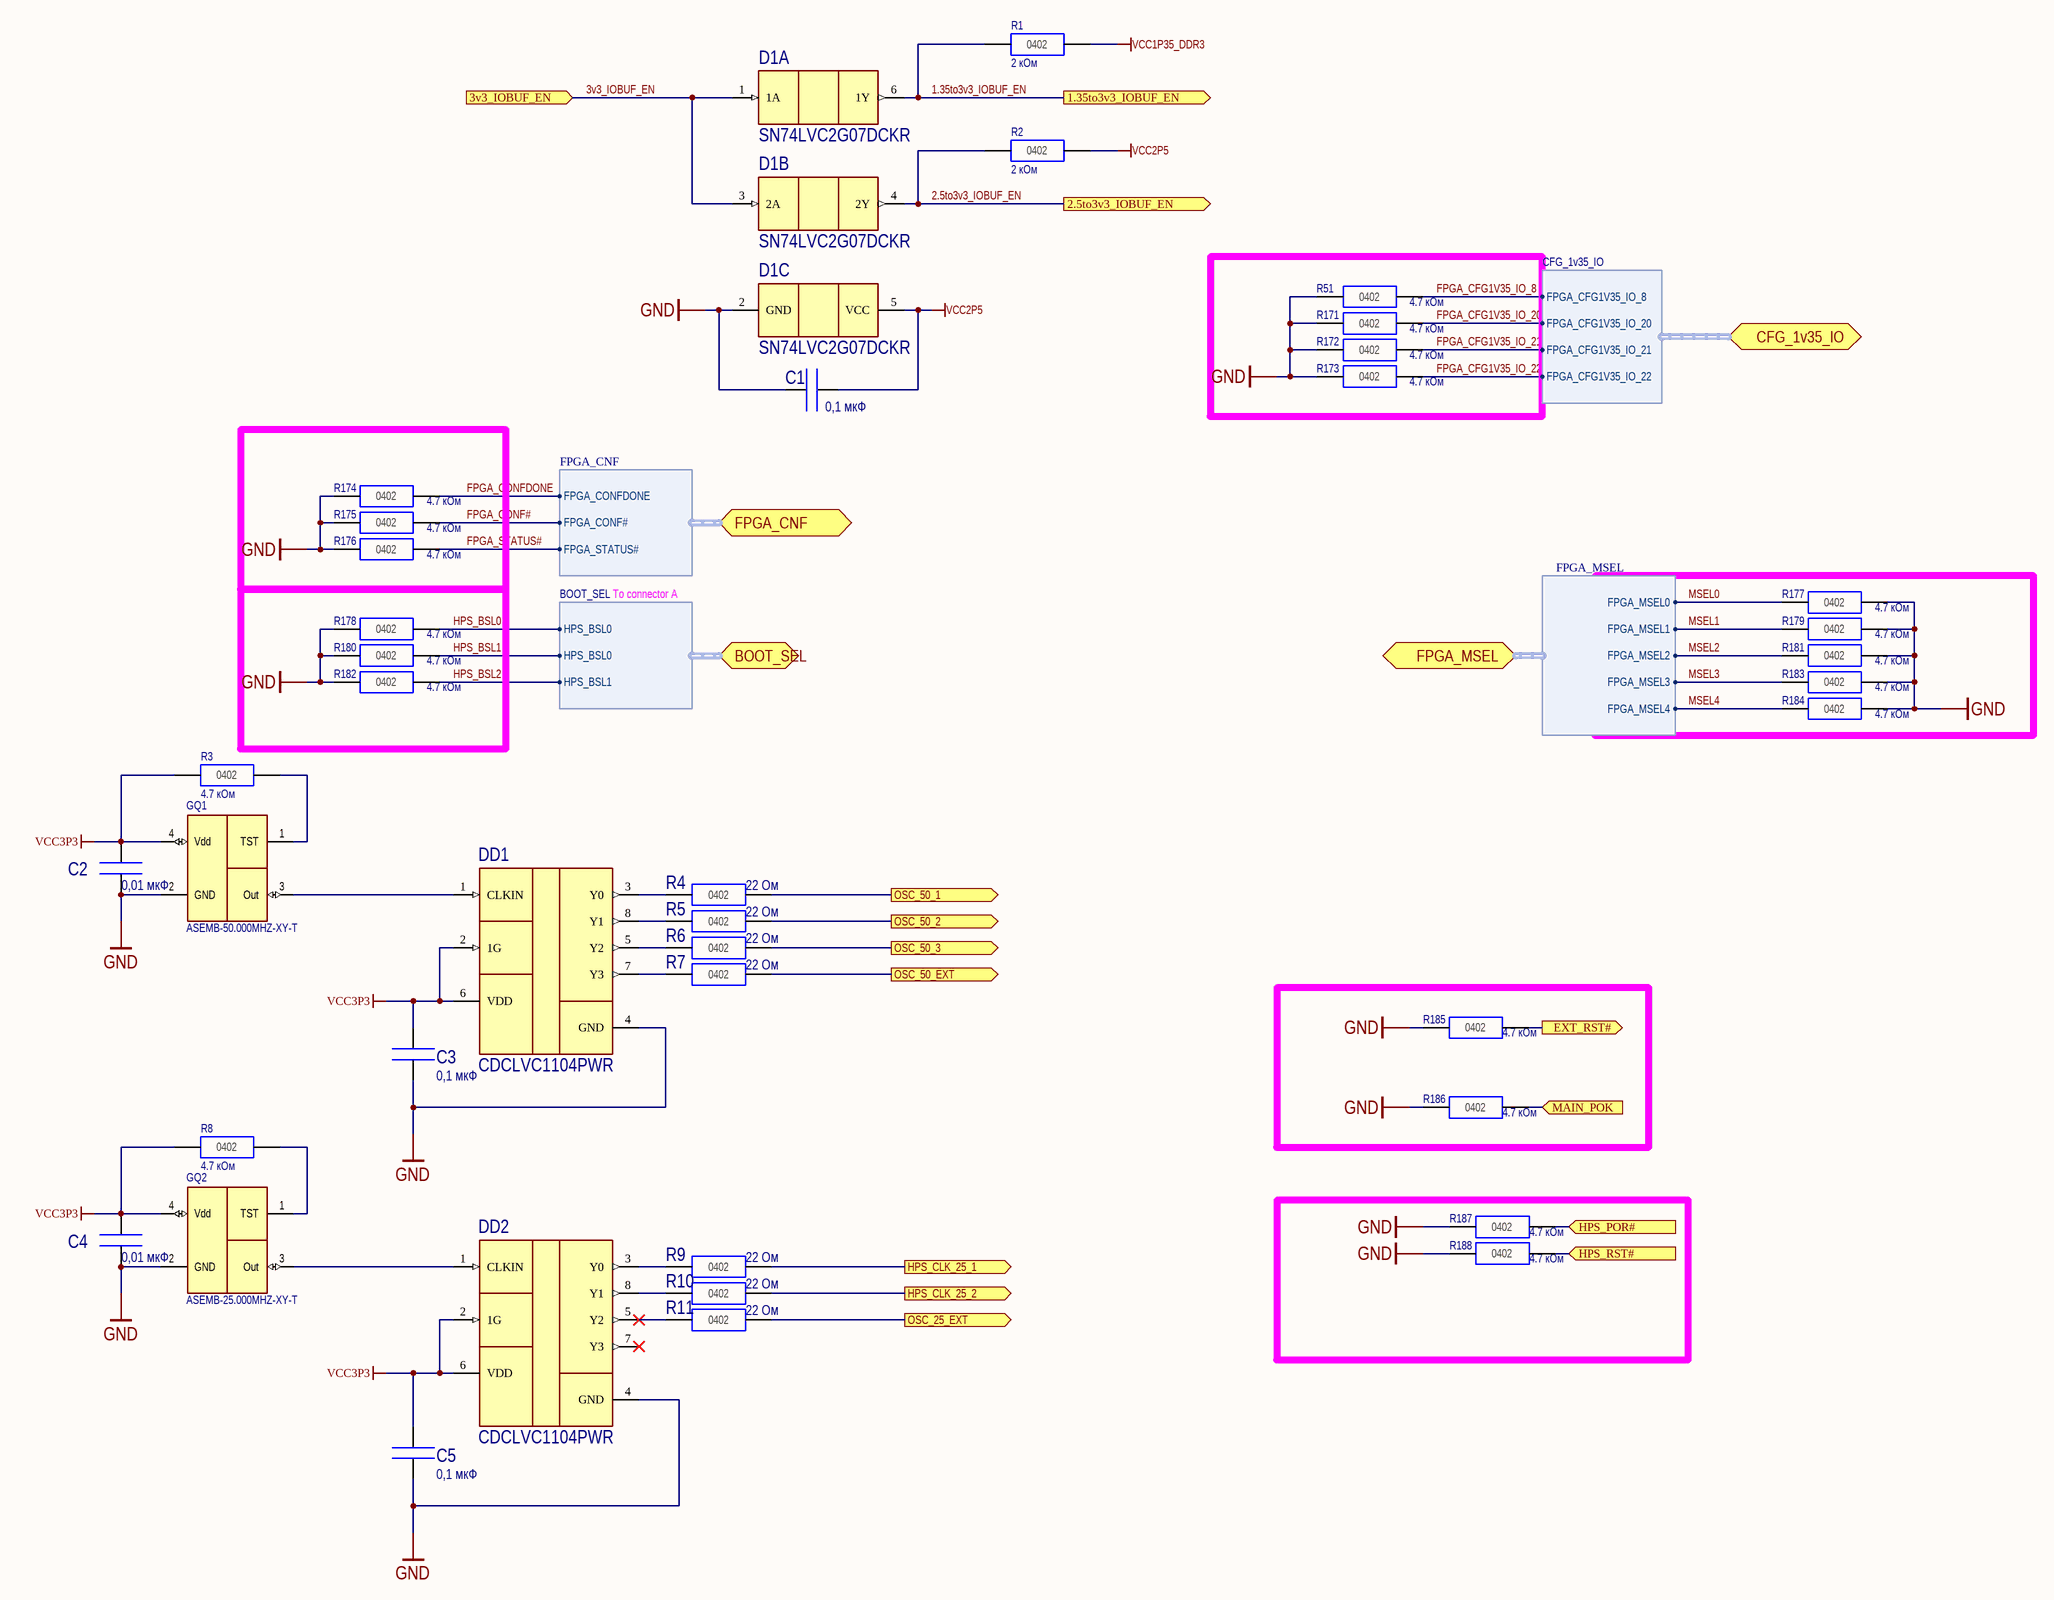
[diagram p8: CLK_src&sys_logic.SchDoc]

### Parts
C1  value 0,1 мкФ  [CC0402(1005)]  (hidden comment: CC0402-X7R-0,1 мкФ-20%-10В)
C2  value 0,01 мкФ  [CC0402(1005)]  (hidden comment: CC0402-X7R-0,01 мкФ-10%-50В)
C3  value 0,1 мкФ  [CC0402(1005)]  (hidden comment: CC0402-X7R-0,1 мкФ-20%-10В)
C4  value 0,01 мкФ  [CC0402(1005)]  (hidden comment: CC0402-X7R-0,01 мкФ-10%-50В)
C5  value 0,1 мкФ  [CC0402(1005)]  (hidden comment: CC0402-X7R-0,1 мкФ-20%-10В)
D1  SN74LVC2G07DCKR  [DCKR]  (parts A,B,C of 3)
DD1  CDCLVC1104PWR  [TSSOP-8]
DD2  CDCLVC1104PWR  [TSSOP-8]
GQ1  ASEMB-50.000MHZ-XY-T  [DFN210P320X100-4N]
GQ2  ASEMB-25.000MHZ-XY-T  [DFN210P320X100-4N]
R1  value 2 кОм  [CR0402(1005)]  (hidden comment: CR0402-2 кОм-±5%)
R2  value 2 кОм  [CR0402(1005)]  (hidden comment: CR0402-2 кОм-±5%)
R3  value 4.7 кОм  [CR0402(1005)]  (hidden comment: CR0402-4.7 кОм-±5%)
R4  value 22 Ом  [CR0402(1005)]  (hidden comment: CR0402-22 Ом-±5%)
R5  value 22 Ом  [CR0402(1005)]  (hidden comment: CR0402-22 Ом-±5%)
R6  value 22 Ом  [CR0402(1005)]  (hidden comment: CR0402-22 Ом-±5%)
R7  value 22 Ом  [CR0402(1005)]  (hidden comment: CR0402-22 Ом-±5%)
R8  value 4.7 кОм  [CR0402(1005)]  (hidden comment: CR0402-4.7 кОм-±5%)
R9  value 22 Ом  [CR0402(1005)]  (hidden comment: CR0402-22 Ом-±5%)
R10  value 22 Ом  [CR0402(1005)]  (hidden comment: CR0402-22 Ом-±5%)
R11  value 22 Ом  [CR0402(1005)]  (hidden comment: CR0402-22 Ом-±5%)
R51  value 4.7 кОм  [CR0402(1005)]  (hidden comment: CR0402-4.7 кОм-±5%)
R171  value 4.7 кОм  [CR0402(1005)]  (hidden comment: CR0402-4.7 кОм-±5%)
R172  value 4.7 кОм  [CR0402(1005)]  (hidden comment: CR0402-4.7 кОм-±5%)
R173  value 4.7 кОм  [CR0402(1005)]  (hidden comment: CR0402-4.7 кОм-±5%)
R174  value 4.7 кОм  [CR0402(1005)]  (hidden comment: CR0402-4.7 кОм-±5%)
R175  value 4.7 кОм  [CR0402(1005)]  (hidden comment: CR0402-4.7 кОм-±5%)
R176  value 4.7 кОм  [CR0402(1005)]  (hidden comment: CR0402-4.7 кОм-±5%)
R177  value 4.7 кОм  [CR0402(1005)]  (hidden comment: CR0402-4.7 кОм-±5%)
R178  value 4.7 кОм  [CR0402(1005)]  (hidden comment: CR0402-4.7 кОм-±5%)
R179  value 4.7 кОм  [CR0402(1005)]  (hidden comment: CR0402-4.7 кОм-±5%)
R180  value 4.7 кОм  [CR0402(1005)]  (hidden comment: CR0402-4.7 кОм-±5%)
R181  value 4.7 кОм  [CR0402(1005)]  (hidden comment: CR0402-4.7 кОм-±5%)
R182  value 4.7 кОм  [CR0402(1005)]  (hidden comment: CR0402-4.7 кОм-±5%)
R183  value 4.7 кОм  [CR0402(1005)]  (hidden comment: CR0402-4.7 кОм-±5%)
R184  value 4.7 кОм  [CR0402(1005)]  (hidden comment: CR0402-4.7 кОм-±5%)
R185  value 4.7 кОм  [CR0402(1005)]  (hidden comment: CR0402-4.7 кОм-±5%)
R186  value 4.7 кОм  [CR0402(1005)]  (hidden comment: CR0402-4.7 кОм-±5%)
R187  value 4.7 кОм  [CR0402(1005)]  (hidden comment: CR0402-4.7 кОм-±5%)
R188  value 4.7 кОм  [CR0402(1005)]  (hidden comment: CR0402-4.7 кОм-±5%)

### Ports
1.35to3v3_IOBUF_EN (out), 2.5to3v3_IOBUF_EN (out), 3v3_IOBUF_EN (in), BOOT_SEL (harness BOOT_SEL), CFG_1v35_IO (harness CFG_1v35_IO), EXT_RST# (out), FPGA_CNF (harness FPGA_CNF), FPGA_MSEL (harness FPGA_MSEL), HPS_CLK_25_1 (out), HPS_CLK_25_2 (out), HPS_POR# (in), HPS_RST# (in), MAIN_POK (in), OSC_25_EXT (out), OSC_50_1 (out), OSC_50_2 (out), OSC_50_3 (out), OSC_50_EXT (out)

### Harnesses
FPGA_MSEL: FPGA_MSEL0, FPGA_MSEL1, FPGA_MSEL2, FPGA_MSEL3, FPGA_MSEL4
FPGA_CNF: FPGA_STATUS#, FPGA_CONF#, FPGA_CONFDONE
BOOT_SEL: HPS_BSL0, HPS_BSL0, HPS_BSL1
CFG_1v35_IO: FPGA_CFG1V35_IO_8, FPGA_CFG1V35_IO_20, FPGA_CFG1V35_IO_21, FPGA_CFG1V35_IO_22

### Nets
GND: C1.1(+) C2.1(+) C3.2(-) C4.1(+) C5.2(-) D1.2(GND) DD1.4(GND) DD2.4(GND) GQ1.2(GND) GQ2.2(GND) R51.1(+) R171.1(+) R172.1(+) R173.1(+) R174.1(+) R175.1(+) R176.1(+) R177.2(-) R178.1(+) R179.2(-) R180.1(+) R181.2(-) R182.1(+) R183.2(-) R184.2(-) R185.1(+) R186.1(+) R187.1(+) R188.1(+)
VCC1P35_DDR3: R1.2(-)
VCC2P5: C1.2(-) D1.5(VCC) R2.2(-)
VCC3P3: C2.2(-) C3.1(+) C4.2(-) C5.1(+) DD1.2(1G) DD1.6(VDD) DD2.2(1G) DD2.6(VDD) GQ1.4(Vdd) GQ2.4(Vdd) R3.1(+) R8.1(+)
1.35to3v3_IOBUF_EN: D1.6(1Y) R1.1(+) ; port 1.35to3v3_IOBUF_EN
2.5to3v3_IOBUF_EN: D1.4(2Y) R2.1(+) ; port 2.5to3v3_IOBUF_EN
3v3_IOBUF_EN: D1.1(1A) D1.3(2A) ; port 3v3_IOBUF_EN
EXT_RST#: R185.2(-) ; port EXT_RST#
FPGA_CFG1V35_IO_8: R51.2(-) ; port CFG_1v35_IO.FPGA_CFG1V35_IO_8
FPGA_CFG1V35_IO_20: R171.2(-) ; port CFG_1v35_IO.FPGA_CFG1V35_IO_20
FPGA_CFG1V35_IO_21: R172.2(-) ; port CFG_1v35_IO.FPGA_CFG1V35_IO_21
FPGA_CFG1V35_IO_22: R173.2(-) ; port CFG_1v35_IO.FPGA_CFG1V35_IO_22
FPGA_CONF#: R175.2(-) ; port FPGA_CNF.FPGA_CONF#
FPGA_CONFDONE: R174.2(-) ; port FPGA_CNF.FPGA_CONFDONE
FPGA_STATUS#: R176.2(-) ; port FPGA_CNF.FPGA_STATUS#
HPS_BSL0: R178.2(-) R180.2(-) ; port BOOT_SEL.HPS_BSL0  [also labelled HPS_BSL1]
HPS_BSL2: R182.2(-) ; port BOOT_SEL.HPS_BSL1
HPS_CLK_25_1: R9.2(-) ; port HPS_CLK_25_1
HPS_CLK_25_2: R10.2(-) ; port HPS_CLK_25_2
MAIN_POK: R186.2(-) ; port MAIN_POK
MSEL0: R177.1(+) ; port FPGA_MSEL.FPGA_MSEL0
MSEL1: R179.1(+) ; port FPGA_MSEL.FPGA_MSEL1
MSEL2: R181.1(+) ; port FPGA_MSEL.FPGA_MSEL2
MSEL3: R183.1(+) ; port FPGA_MSEL.FPGA_MSEL3
MSEL4: R184.1(+) ; port FPGA_MSEL.FPGA_MSEL4
NetD2_C27: R188.2(-) ; port HPS_RST#
NetD2_F23: R187.2(-) ; port HPS_POR#
NetDD1_1: DD1.1(CLKIN) GQ1.3(Out)
NetDD1_3: DD1.3(Y0) R4.1(+)
NetDD1_5: DD1.5(Y2) R6.1(+)
NetDD1_7: DD1.7(Y3) R7.1(+)
NetDD1_8: DD1.8(Y1) R5.1(+)
NetDD2_1: DD2.1(CLKIN) GQ2.3(Out)
NetDD2_3: DD2.3(Y0) R9.1(+)
NetDD2_5: DD2.5(Y2) R11.1(+)
NetDD2_8: DD2.8(Y1) R10.1(+)
NetGQ1_1: GQ1.1(TST) R3.2(-)
NetGQ2_1: GQ2.1(TST) R8.2(-)
NetR4_2: R4.2(-) ; port OSC_50_1
NetR5_2: R5.2(-) ; port OSC_50_2
NetR6_2: R6.2(-) ; port OSC_50_3
NetR7_2: R7.2(-) ; port OSC_50_EXT
NetR11_2: R11.2(-) ; port OSC_25_EXT

Not connected (* = marked no-connect by the designer): DD2 7(Y3)*

### Notes on the sheet
- To connector A
- (in symbol CR0402-#-±5%) 0402

### Library data of the parts
C1-C5 = CC0402-X7R-#-20%-10В: Чип конденсатор керамический; Supplier 1: Digi-Key
  C1 C3 C5: Supplier Part Number 1: 399-3520-1-ND
  C2 C4: Supplier Part Number 1: 490-4516-2-ND
D1 = SN74LVC2G06: Supplier 1: Digi-Key; Supplier Part Number 1: 296-13493-2-ND
DD1 DD2 = CDCLVC1104PWR: High-Performance  Clock Buffer 1:4; Supplier 1: Digi-Key; Supplier Part Number 1: 296-27549-1-ND
GQ1 GQ2 = OSC-ABRCN-ASE3: Dual High Side Switch With OC_DET 500mA/CH; Manufacturer Name: Abracon LLC
  GQ1: Manufacturer Part No.: ASEMB-50.000MHZ-XY-T
  GQ2: Manufacturer Part No.: ASEMB-25.000MHZ-XY-T
R1-R11 R51 R171-R188 = CR0402-#-±5%: as R77 on sheet HPS_IOs; Supplier 1: Digi-Key
  R1 R2: Supplier Part Number 1: 311-2.0KJRTR-ND
  R3 R8 R51 R171-R188: Supplier Part Number 1: 311-4.7KJRTR-ND
  R4-R7 R9-R11: Supplier Part Number 1: 311-10.0KLRDKR-ND

## Nets that join several sheets
GND: Conn_A (39 pins), Conn_B (84 pins), Conn_C (66 pins), HPS_DDR3 (68 pins), HPS_IOs (C52.1 D9.4 R77.1), CLK_src&sys_logic (29 pins)
VCC1P2: Conn_B (R30.2 R31.2), Conn_C (R35.2 R169.2)
VCC1P8: Conn_B (R32.1 R33.1), Conn_C (R34.1 R170.1)
VCC1P35_DDR3: HPS_DDR3 (40 pins), CLK_src&sys_logic (R1.2)
VCC2P5: Conn_A (R12.1 R13.2 R18.1 R19.2), CLK_src&sys_logic (C1.2 D1.5 R2.2)
VCC3P3: Conn_A (R20.1 R21.2 R26.1 R27.2), HPS_DDR3 (C47.1 D8.10 R73.1 R74.1), HPS_IOs (C52.2 D9.8), CLK_src&sys_logic (12 pins)
EXT_RST#: Conn_A (X1.93), CLK_src&sys_logic (R185.2)
HPS_BSL0: Conn_A (R16.12), HPS_IOs (D2.A18 D2.H20 D9.1), CLK_src&sys_logic (R178.2 R180.2)
HPS_BSL2: HPS_IOs (D2.D20), CLK_src&sys_logic (R182.2)
HPS_CAN_RX: Conn_A (R22.12), HPS_IOs (D2.B22)
HPS_CAN_TX: Conn_A (R22.13), HPS_IOs (D2.G22)
HPS_CLK_25_1: HPS_IOs (D2.D25), CLK_src&sys_logic (R9.2)
HPS_CLK_25_2: HPS_IOs (D2.F25), CLK_src&sys_logic (R10.2)
HPS_GPIO0: Conn_A (R17.1), HPS_IOs (D2.B26)
HPS_GPIO1: Conn_A (R25.4), HPS_IOs (D2.A24)
HPS_GPIO2: Conn_A (R25.1), HPS_IOs (D2.G21)
HPS_GPIO3: Conn_A (R14.15), HPS_IOs (D2.E24)
HPS_GPIO4: Conn_A (R14.16), HPS_IOs (D2.D24)
HPS_GPIO5: Conn_A (R16.11), HPS_IOs (D2.C19)
HPS_GPIO6: Conn_A (R16.16), HPS_IOs (D2.B17)
HPS_GPIO7: Conn_A (R22.11), HPS_IOs (D2.H17)
HPS_GPIO8: Conn_A (R22.14), HPS_IOs (D2.C18)
HPS_GPIO9: Conn_A (R24.9), HPS_IOs (D2.G17)
HPS_GPIO10: Conn_A (R24.10), HPS_IOs (D2.E18)
HPS_GPIO11: Conn_A (R24.11), HPS_IOs (D2.E17)
HPS_GPIO12: Conn_A (R24.12), HPS_IOs (D2.F16)
HPS_GPIO13: Conn_A (R24.13), HPS_IOs (D2.B15)
HPS_I2C0_CL: Conn_A (R22.10), HPS_IOs (D2.E23)
HPS_I2C0_DA: Conn_A (R22.9), HPS_IOs (D2.C24)
HPS_I2C1_CL: Conn_A (R22.16), HPS_IOs (D2.H23)
HPS_I2C1_DA: Conn_A (R22.15), HPS_IOs (D2.A25)
HPS_SD_CLK: Conn_A (R14.14), HPS_IOs (D2.A16)
HPS_SD_CMD: Conn_A (R14.13), HPS_IOs (D2.F18)
HPS_SD_D0: Conn_A (R14.9), HPS_IOs (D2.G18)
HPS_SD_D1: Conn_A (R14.10), HPS_IOs (D2.C17)
HPS_SD_D2: Conn_A (R14.11), HPS_IOs (D2.D17)
HPS_SD_D3: Conn_A (R14.12), HPS_IOs (D2.B16)
HPS_SPI_MISO: Conn_A (R16.13), HPS_IOs (D2.B23)
HPS_SPI_MOSI: Conn_A (R16.14), HPS_IOs (D2.C22)
HPS_SPI_SCK: Conn_A (R16.15), HPS_IOs (D2.A23)
HPS_UART0_RX: Conn_A (R25.3), HPS_IOs (D2.B25)
HPS_UART0_TX: Conn_A (R25.2), HPS_IOs (D2.C25)
HPS_UART1_RX: Conn_A (R16.10), HPS_IOs (D2.C23)
HPS_UART1_TX: Conn_A (R16.9), HPS_IOs (D2.D22)
HPS_USB_CKO: Conn_A (R25.8), HPS_IOs (D2.N16)
HPS_USB_D0: Conn_A (R23.8), HPS_IOs (D2.E16)
HPS_USB_D1: Conn_A (R23.7), HPS_IOs (D2.G16)
HPS_USB_D2: Conn_A (R23.6), HPS_IOs (D2.D16)
HPS_USB_D3: Conn_A (R23.5), HPS_IOs (D2.D14)
HPS_USB_D4: Conn_A (R23.4), HPS_IOs (D2.A15)
HPS_USB_D5: Conn_A (R23.3), HPS_IOs (D2.C14)
HPS_USB_D6: Conn_A (R23.2), HPS_IOs (D2.D15)
HPS_USB_D7: Conn_A (R23.1), HPS_IOs (D2.M17)
HPS_USB_DIR: Conn_A (R25.6), HPS_IOs (D2.E14)
HPS_USB_NXT: Conn_A (R25.5), HPS_IOs (D2.A14)
HPS_USB_STP: Conn_A (R25.7), HPS_IOs (D2.C15)
MAIN_POK: Conn_A (X1.99), CLK_src&sys_logic (R186.2)
NetD2_C27: HPS_IOs (D2.C27), CLK_src&sys_logic (R188.2)
NetD2_F23: HPS_IOs (D2.F23), CLK_src&sys_logic (R187.2)
NetR7_2: Conn_A (X1.95), CLK_src&sys_logic (R7.2)
NetR11_2: Conn_A (X1.91), CLK_src&sys_logic (R11.2)
RGMI_MDC: Conn_A (R17.8), HPS_IOs (D2.B21)
RGMI_MDIO: Conn_A (R15.2), HPS_IOs (D2.E21)
RGMI_RX_CLK: Conn_A (R17.7), HPS_IOs (D2.G20)
RGMI_RX_CTL: Conn_A (R17.6), HPS_IOs (D2.K17)
RGMI_RXD0: Conn_A (R17.5), HPS_IOs (D2.A21)
RGMI_RXD1: Conn_A (R17.4), HPS_IOs (D2.B20)
RGMI_RXD2: Conn_A (R17.3), HPS_IOs (D2.B18)
RGMI_RXD3: Conn_A (R17.2), HPS_IOs (D2.D21)
RGMI_TX_CLK: Conn_A (R15.8), HPS_IOs (D2.H19)
RGMI_TX_CTL: Conn_A (R15.7), HPS_IOs (D2.A20)
RGMI_TXD0: Conn_A (R15.6), HPS_IOs (D2.F20)
RGMI_TXD1: Conn_A (R15.5), HPS_IOs (D2.J19)
RGMI_TXD2: Conn_A (R15.4), HPS_IOs (D2.F21)
RGMI_TXD3: Conn_A (R15.3), HPS_IOs (D2.F19)

## Assembly variants
NO MEMORY NO SDRAM NO BLUETOOTH DIMS_DSP_V4.1.1: not fitted DA1 DD4 MP1 XP2 XS1
FULL COMPLECT DIMS_DSP_V4.1.1: not fitted XP2 XS1